# EasyEDA schematic SCH_TB6612扩展板24_2025-07-27.json
TITLE: Sheet_1; REV: 1.0; Sheet: 1/1; Drawn By: FanXXX; Company: Your Company
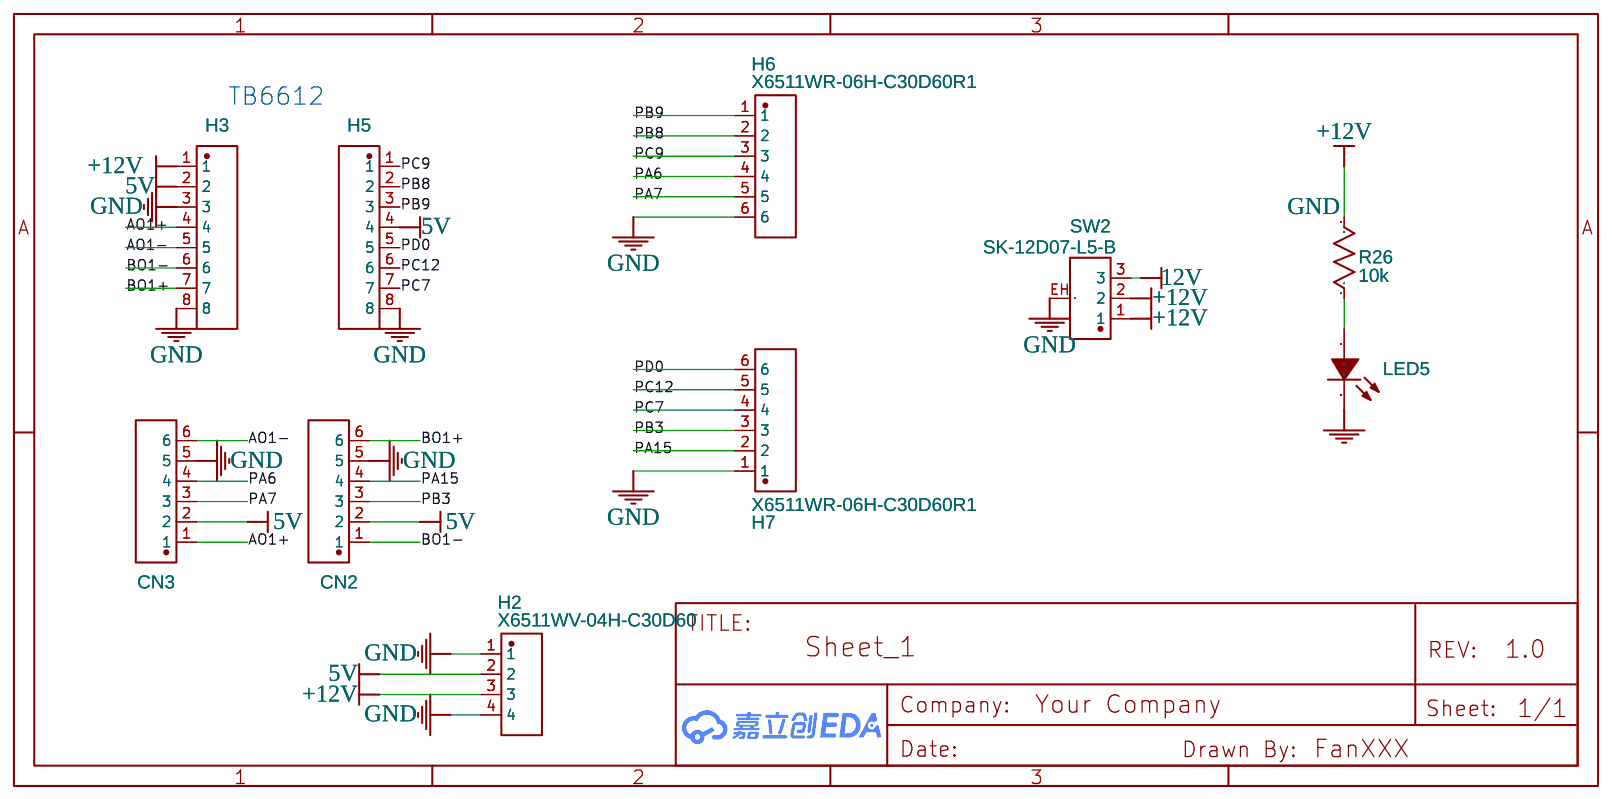
[diagram p0: schematic sheet]

## Parts
CN2  X8821WR-06S-N0SN  [CONN-TH_6P-P2.50_X8821WR-06S-N2SN]
CN3  X8821WR-06S-N0SN  [CONN-TH_6P-P2.50_X8821WR-06S-N2SN]
H2  X6511WV-04H-C30D60  [HDR-TH_4P-P2.54-V-M]
H3  X6511FV-08-C85D32  [HDR-TH_8P-P2.54-V-F]
H5  X6511FV-08-C85D32  [HDR-TH_8P-P2.54-V-F]
H6  X6511WR-06H-C30D60R1  [HDR-TH_6P-P2.54-H-M-W7.7-P]
H7  X6511WR-06H-C30D60R1  [HDR-TH_6P-P2.54-H-M-W7.7-P]
LED5  FC-A2012WD-457H5  [LED0805-R-RD]
R26  10k  [R0805]
SW2  SK-12D07-L5-B  [SW-TH_SK-12D07-X-X]

## Library data of the parts
CN2 CN3 = X8821WR-06S-N0SN: Contributor: LCSC; Supplier: LCSC; Supplier Part: C388743; Manufacturer: XKB Connectivity(中国星坤); JLCPCB Part Class: Extended Part
H2 = X6511WV-04H-C30D60: Contributor: LCSC; Supplier: LCSC; Supplier Part: C706876; Manufacturer: XKB Connectivity(中国星坤); JLCPCB Part Class: Extended Part
H3 H5 = X6511FV-08-C85D32: Contributor: LCSC; Supplier: LCSC; Supplier Part: C718237; Manufacturer: XKB Connectivity(中国星坤); JLCPCB Part Class: Extended Part; link: https://so.szlcsc.com/global.html?k=C718237&ref=editor
H6 H7 = X6511WR-06H-C30D60R1: Contributor: LCSC; Supplier: LCSC; Supplier Part: C2883844; Manufacturer: XKB Connectivity(中国星坤); JLCPCB Part Class: Extended Part
LED5 = FC-A2012WD-457H5: Supplier: LCSC; Manufacturer: NATIONSTAR; Supplier Part: C84258; Paste Type: recommend; Assembly Type: smtWeld
R26 = R_0603_US: Contributor: LCEDA_Lib
SW2 = SK-12D07-L5-B: Contributor: LCSC; Supplier: LCSC; Supplier Part: C480341; Manufacturer: XKB Enterprise; JLCPCB Part Class: Extended Part

## Nets
5V: CN2.2 CN3.2 H2.2 H3.2 H5.4
12V: SW2.3
+12V: H2.3 H3.1 R26.2 SW2.1 SW2.2
GND: CN2.5 CN3.5 H2.1 H2.4 H3.3 H3.8 H5.8 H6.6 H7.1 LED5.2(K) SW2.EH
AO1+: CN3.1 H3.4
AO1-: CN3.6 H3.5
BO1+: CN2.6 H3.7
BO1-: CN2.1 H3.6
PA6: CN3.4 H6.4
PA7: CN3.3 H6.5
PA15: CN2.4 H7.2
PB3: CN2.3 H7.3
PB8: H5.2 H6.2
PB9: H5.3 H6.1
PC7: H5.7 H7.4
PC9: H5.1 H6.3
PC12: H5.6 H7.5
PD0: H5.5 H7.6
Net-(LED5-1): LED5.1(A) R26.1

## Notes on the sheet
- TB6612
